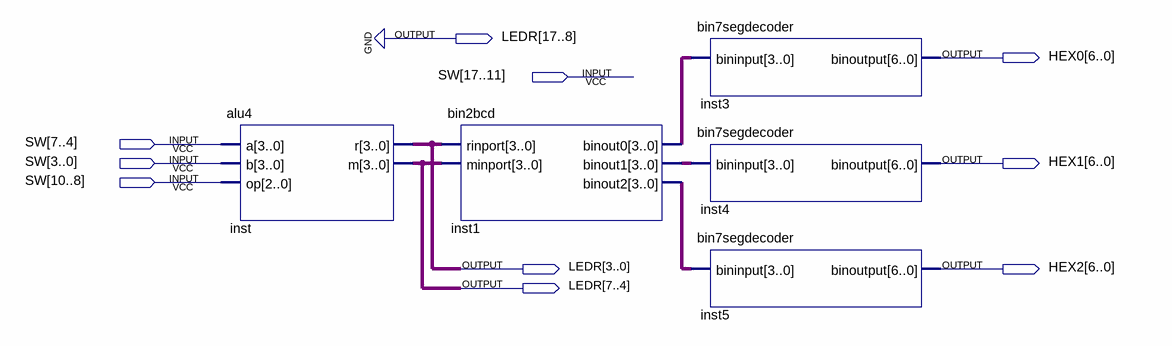
[diagram p0: schematic sheet]
// Quartus schematic ALUDemo.bdf as structural Verilog: 5 symbols, 10 pins
module ALUDemo (
  input  [17:0] SW,
  output [17:0] LEDR,
  output [6:0] HEX0,
  output [6:0] HEX1,
  output [6:0] HEX2
);

  wire [3:0] inst1_binout0, inst1_binout1, inst1_binout2;

  alu4 inst (.a(SW[7:4]), .b(SW[3:0]), .op(SW[10:8]), .r(LEDR[3:0]), .m(LEDR[7:4]));
  bin2bcd inst1 (
    .rinport(LEDR[3:0]), .minport(LEDR[7:4]), .binout0(inst1_binout0), .binout1(inst1_binout1),
    .binout2(inst1_binout2));
  bin7segdecoder inst3 (.bininput(inst1_binout0), .binoutput(HEX0));
  bin7segdecoder inst4 (.bininput(inst1_binout1), .binoutput(HEX1));
  bin7segdecoder inst5 (.bininput(inst1_binout2), .binoutput(HEX2));

  assign LEDR[17:8] = {10{1'b0}};
endmodule
